# EAGLE design 5VAC-DCReg (EAGLE 9.6.2)
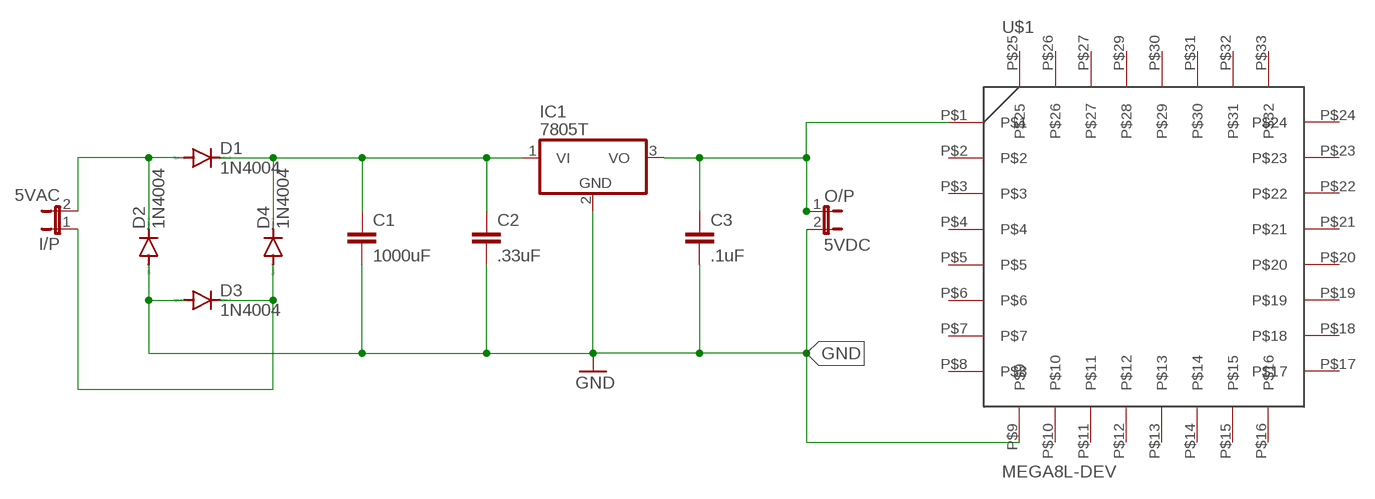
[diagram p0: schematic, sheet 1]

## Parts
C1  1000uF  C2,5-3  [C2.5-3]
C2  .33uF  C2,5-3  [C2.5-3]
C3  .1uF  C2,5-3  [C2.5-3]
D1  1N4004  [DO41-10]
D2  1N4004  [DO41-10]
D3  1N4004  [DO41-10]
D4  1N4004  [DO41-10]
I/P  5VAC  JP1E  [JP1]
IC1  7805T  [TO220H]
O/P  5VDC  JP1E  [JP1]
U$1  MEGA8L-DEV  [TQFP-MEGA8L]

## Nets
GND: C1.2 C2.2 C3.2 D2.A D3.A IC1.2(GND) O/P.2 U$1.P$9
N$1: D3.C D4.A I/P.1
N$3: C3.1 IC1.3(VO) O/P.1 U$1.P$1
N$4: D1.A D2.C I/P.2
N$7: C1.1 C2.1 D1.C D4.C IC1.1(VI)
Unconnected: U$1.P$2 U$1.P$3 U$1.P$4 U$1.P$5 U$1.P$6 U$1.P$7 U$1.P$8 U$1.P$10 U$1.P$11 U$1.P$12 U$1.P$13 U$1.P$14 U$1.P$15 U$1.P$16 U$1.P$17 U$1.P$18 U$1.P$19 U$1.P$20 U$1.P$21 U$1.P$22 U$1.P$23 U$1.P$24 U$1.P$25 U$1.P$26 U$1.P$27 U$1.P$29 U$1.P$30 U$1.P$31 U$1.P$32 U$1.P$33

## Library data of the parts
C1-C3 = capacitor-wima:C: CAPACITOR naming: grid - package width
D1-D4 = diode:1N4004: DIODE general purpose rectifier, 1 A
I/P O/P = jumper:JP1E: JUMPER
IC1 = linear:78*: Positive VOLTAGE REGULATOR Source: http://cache.national.com/ds/LM/LM78L05.pdf http://www.fairchildsemi.com/ds/LM/LM7805.pdf
U$1 = SAM-MEGA8L:MEGA8L-DEV

## Board
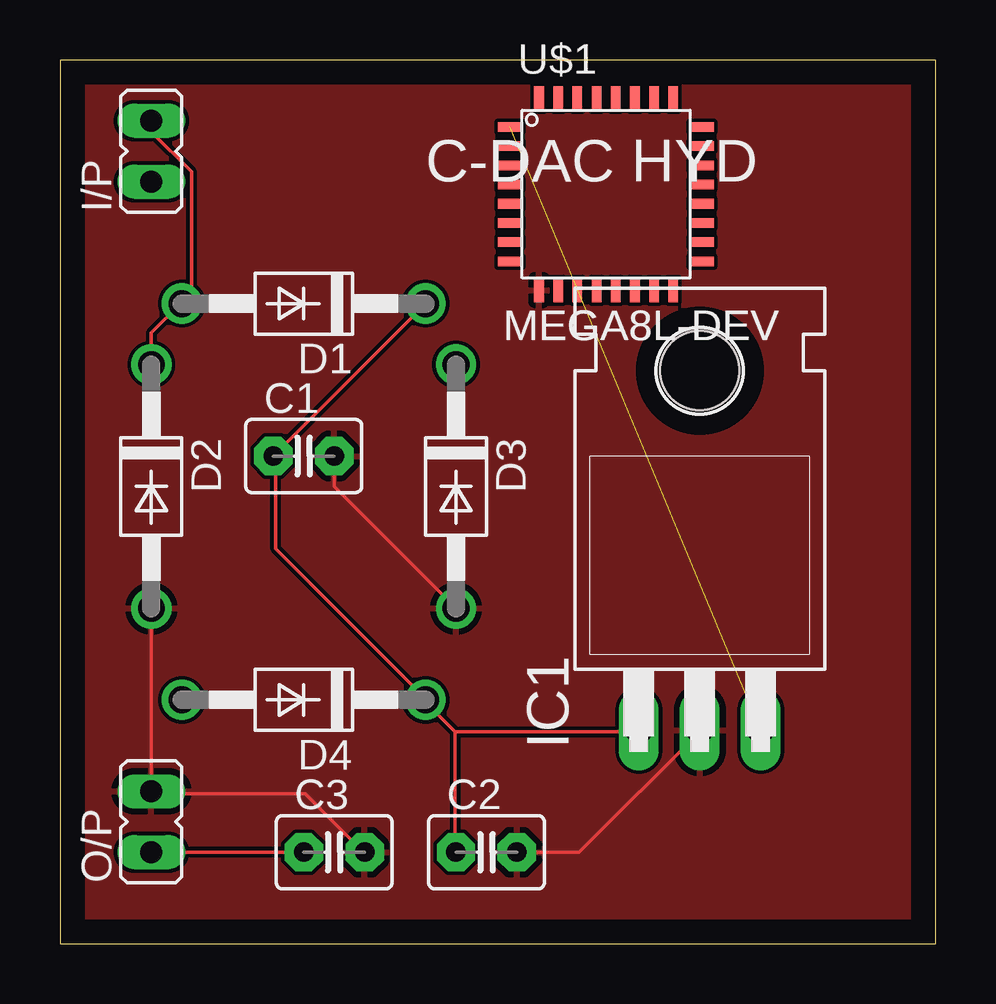
[diagram p1: board, top side]
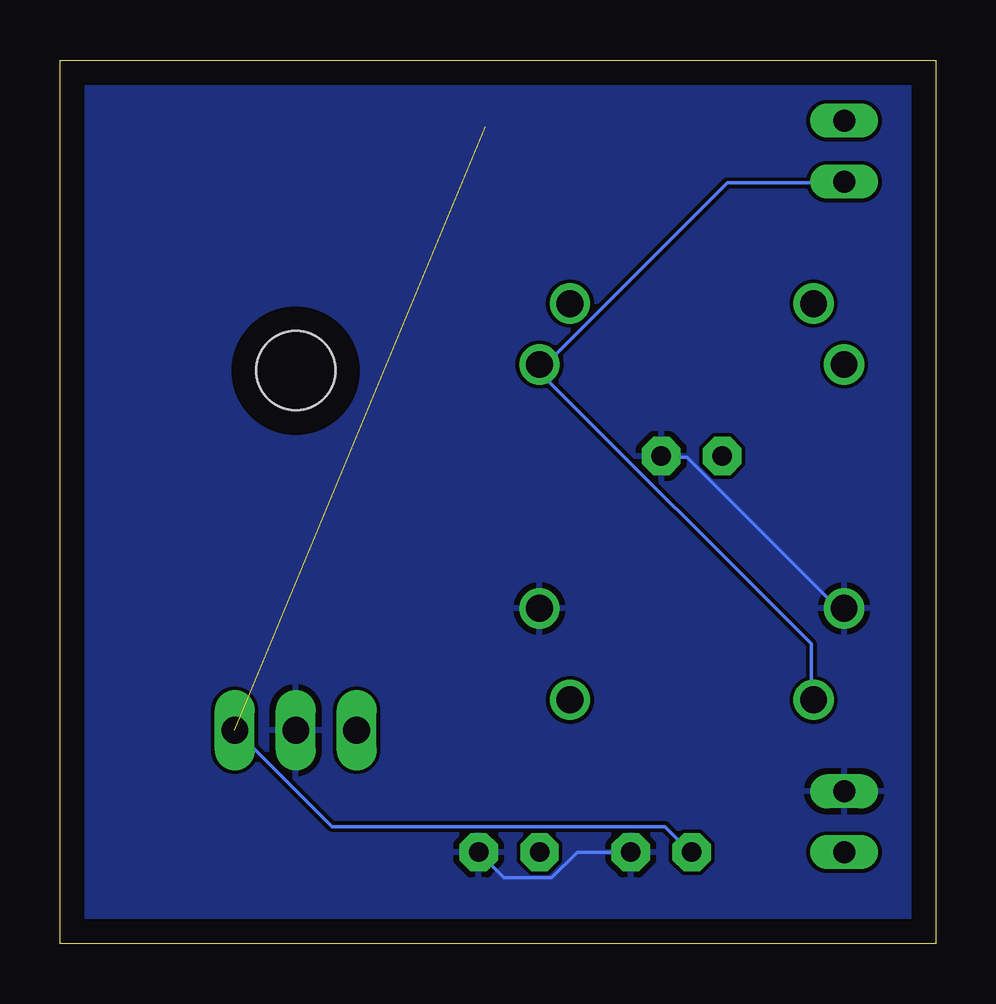
[diagram p2: board, bottom side, seen from below]

Size 36.5 x 36.82 mm. Coordinates in mm from the lower left corner, seen from the top.
Outline: 0,0 36.5,0 36.5,36.82 0,36.82 0,0
Copper layers (1*16): Top 0.035mm / dielectric 1.5mm / Bottom 0.035mm
Design rules "default": minimum track width 6mil, minimum drill 0.35mm, track to track 6mil, track to pad 6mil, pad to pad 6mil, via to via 6mil, smd to smd 6mil, copper to edge 40mil, drill to drill 6mil, minimum pad ring 10mil, minimum via ring 8mil, stop-mask expansion 4mil, vias tented up to drill 0mil, thermal gap 10mil

### Footprints (pad centres in the part's own frame; a part is rotated, then mirrored left to right if it is on the bottom)
C2.5-3 = drill 0.813 pad 1.6 octagon: 1 -1.27,0; 2 1.27,0
DO41-10 = drill 1.118: A 5.08,0; C -5.08,0
JP1 = drill 0.914 long: 1 0,-1.27; 2 0,1.27
TO220H = drill 1.118 long: 1 -2.54,-10.16; 2 0,-10.16; 3 2.54,-10.16 | hole 3.302: 0,4.826
TQFP-MEGA8L = smd 1 x 0.4: P$1 4.8,9.9; P$2 4.8,9.1; P$3 4.8,8.3; P$4 4.8,7.5; P$5 4.8,6.7; P$6 4.8,5.9; P$7 4.8,5.1; P$8 4.8,4.3; P$17 12.8,4.3; P$18 12.8,5.1; P$19 12.8,5.9; P$20 12.8,6.7; P$21 12.8,7.5; P$22 12.8,8.3; P$23 12.8,9.1; P$24 12.8,9.9 | smd 0.4 x 1: P$9 6,3.1; P$10 6.8,3.1; P$11 7.6,3.1; P$12 8.4,3.1; P$13 9.2,3.1; P$14 10,3.1; P$15 10.8,3.1; P$16 11.6,3.1; P$25 11.6,11.1; P$26 10.8,11.1; P$27 10,11.1; P$29 9.2,11.1; P$30 8.4,11.1; P$31 7.6,11.1; P$32 6.8,11.1; P$33 6,11.1

### Placement (x,y rotation side)
C1  10.16,20.32 0 top
C2  17.78,3.81 0 top
C3  11.43,3.81 0 top
D1  10.16,26.67 180 top
D2  3.81,19.05 270 top
D3  16.51,19.05 270 top
D4  10.16,10.16 180 top
I/P  3.81,33.02 0 top
IC1  26.67,19.05 0 top
O/P  3.81,5.08 0 top
U$1  13.97,24.13 0 top

### Tracks (layer width: path | path; a pad name or v marks a point on that pad's centre or on a via)
GND
  Top 0.152: C1.2 11.43,19.05 D3.A | D2.A O/P.2 3.81,6.25 10.21,6.25 12.65,3.81 C3.2 | C2.2 21.64,3.81 26.67,8.84 IC1.2
  Bottom 0.152: C3.2 14.94,3.81 16,2.74 17.98,2.74 C2.2 | C1.2 11.43,20.27 10.36,20.27 4.12,14.02 3.81,14.02 D2.A
  pour Top: 0,38.1 39.37,38.1 39.37,-1.27 39.37,-2.54 -2.54,-2.54 -2.54,38.1
  pour Bottom: -5.08,39.37 40.64,39.37 40.64,-3.81 -5.08,-3.81
N$1
  Bottom 0.152: I/P.1 3.81,31.7 8.69,31.7 16.15,24.23 16.46,24.23 D3.C 16.46,24.08 16.46,23.77 5.18,12.5 5.18,10.21 D4.A
N$3  (1 unrouted)
  Top 0.152: C3.1 O/P.1
  Bottom 0.152: IC1.3 29.11,8.84 25.15,4.88 11.28,4.88 10.21,3.81 C3.1
N$4
  Top 0.152: I/P.2 3.81,33.83 5.49,32.16 5.49,26.98 5.18,26.67 D1.A 5.03,26.67 3.81,25.45 D2.C
N$7
  Top 0.152: D1.C C1.1 8.99,20.27 8.99,16.46 15.24,10.21 D4.C 15.24,10.06 16.46,8.84 | 16.46,8.84 16.46,3.81 C2.1 | 16.46,8.84 24.08,8.84 IC1.1

### Text on the board
tPlace: C-DAC HYD